# Altium schematic sheet Sheet1.SCHDOC
size 297 x 209 mm; SheetNumber: 1; SheetTotal: 1; DocumentName: Sheet1.SCHDOC
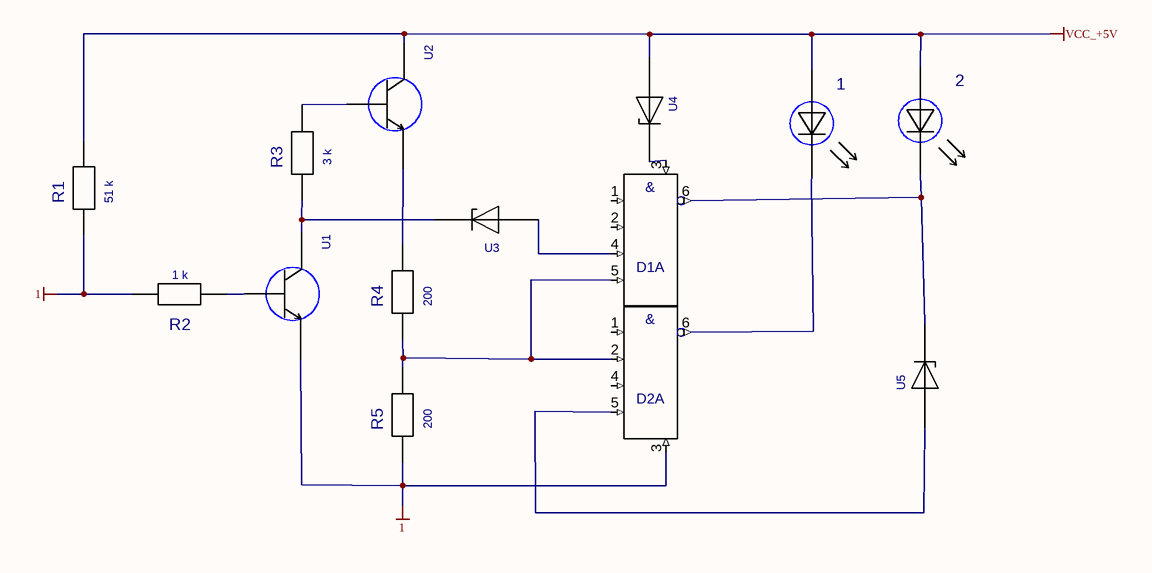
[diagram p0: Sheet1.SCHDOC]

## Parts
1  DIODECORPUSMIC  [DIODE_CORPUS]  (value not drawn)
2  DIODECORPUSMIC  [DIODE_CORPUS]  (value not drawn)
D1  MICNEW  [DIP14]  (value not drawn)  (part A of 2)
D2  MICNEW2  [DIP14]  (value not drawn)  (part A of 2)
R1  value 51 k  [RES]  (hidden comment: RES)
R2  value 1 k  [RES]  (hidden comment: RES)
R3  value 3 k  [RES]  (hidden comment: RES)
R4  value 200  [RES]  (hidden comment: RES)
R5  value 200  [RES]  (hidden comment: RES)
U1  TRANSISTOR  [TRANSISTOR CORPUS]  (value not drawn)
U2  TRANSISTOR  [TRANSISTOR CORPUS]  (value not drawn)
U3  DIODE  [DIODE_CORPUS]  (value not drawn)
U4  DIODE  [DIODE_CORPUS]  (value not drawn)
U5  DIODE  [DIODE_CORPUS]  (value not drawn)

## Nets
1: D2.3(IN6) R1.1 R2.2 R5.1 U1.C
GND: D1.7(GND) D2.7(GND)
VCC: D1.14(VCC) D2.14(VCC)
VCC_+5V: 1.1(A1) 2.1(A1) R1.2 U2.E U4.2
Net1_2: 1.2(A2) D2.6(OUT)
Net2_2: 2.2(A2) D1.6(OUT) U5.1
NetD1_3: D1.3(IN6) U4.1
NetD1_4: D1.4(IN3) U3.2
NetD1_5: D1.5(IN4) D2.2(IN1) R4.1 R5.2
NetD2_5: D2.5(IN4) U5.2
NetR2_1: R2.1 U1.B
NetR3_1: R3.1 U1.E U3.1
NetR3_2: R3.2 U2.B
NetR4_2: R4.2 U2.C

Not connected (* = marked no-connect by the designer): D1 1(IN0) 2(IN1); D2 1(IN0) 4(IN3)

## Notes on the sheet
- (in symbol MICNEW, part A) &
- (in symbol MICNEW2, part A) &

## Library data of the parts
D1 = MICNEW: Value: *
D2 = MICNEW2: Value: *